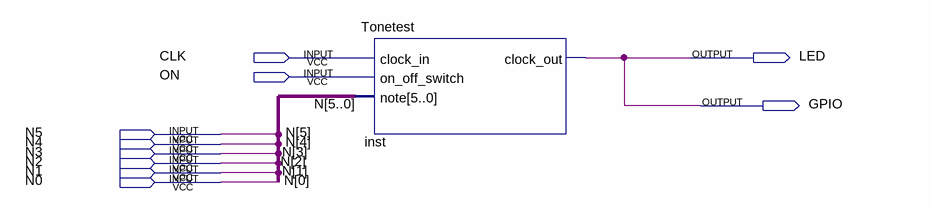
[diagram p0: schematic sheet]
// Quartus schematic Tonetestblock.bdf as structural Verilog: 1 symbols, 10 pins
module Tonetestblock (
  input  CLK,
  input  ON,
  input  N5,
  input  N4,
  input  N3,
  input  N2,
  input  N1,
  input  N0,
  output LED,
  output GPIO
);

  Tonetest inst (.clock_in(CLK), .on_off_switch(ON), .note({N5, N4, N3, N2, N1, N0}), .clock_out(GPIO));

  assign LED = GPIO;
endmodule
